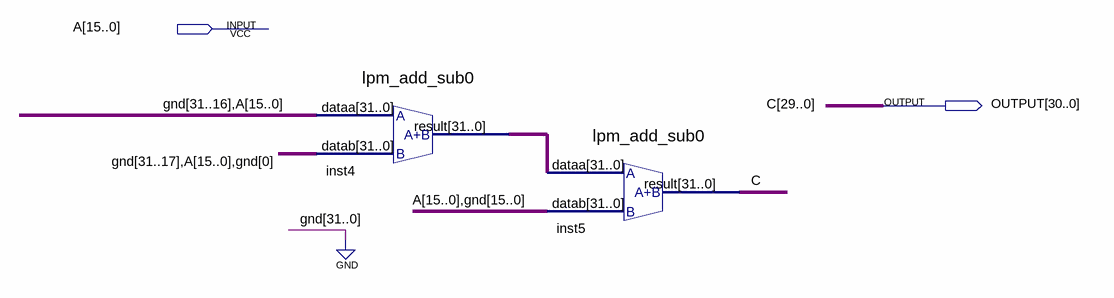
[diagram p0: schematic sheet]
// Quartus schematic a05_lab2RANDU.bdf as structural Verilog: 2 symbols, 2 pins
module a05_lab2RANDU (
  input  [15:0] A,
  output [30:0] OUTPUT
);

  wire C;
  wire [31:0] inst4_result;

  lpm_add_sub0 inst4 (.dataa({{16{1'b0}}, A}), .datab({{15{1'b0}}, A, 1'b0}), .result(inst4_result));
  lpm_add_sub0 inst5 (.dataa(inst4_result), .datab({A, {16{1'b0}}}), .result(C));
endmodule
